# Altium schematic sheet Connectors.SchDoc
size 431 x 279 mm; Organization: Machine Intelligence Laboratory; Address1: 1889 Museum Rd; Address2: Room 3001; Address3: Gainesville, FL, 32611; SheetNumber: 1; SheetTotal: 4
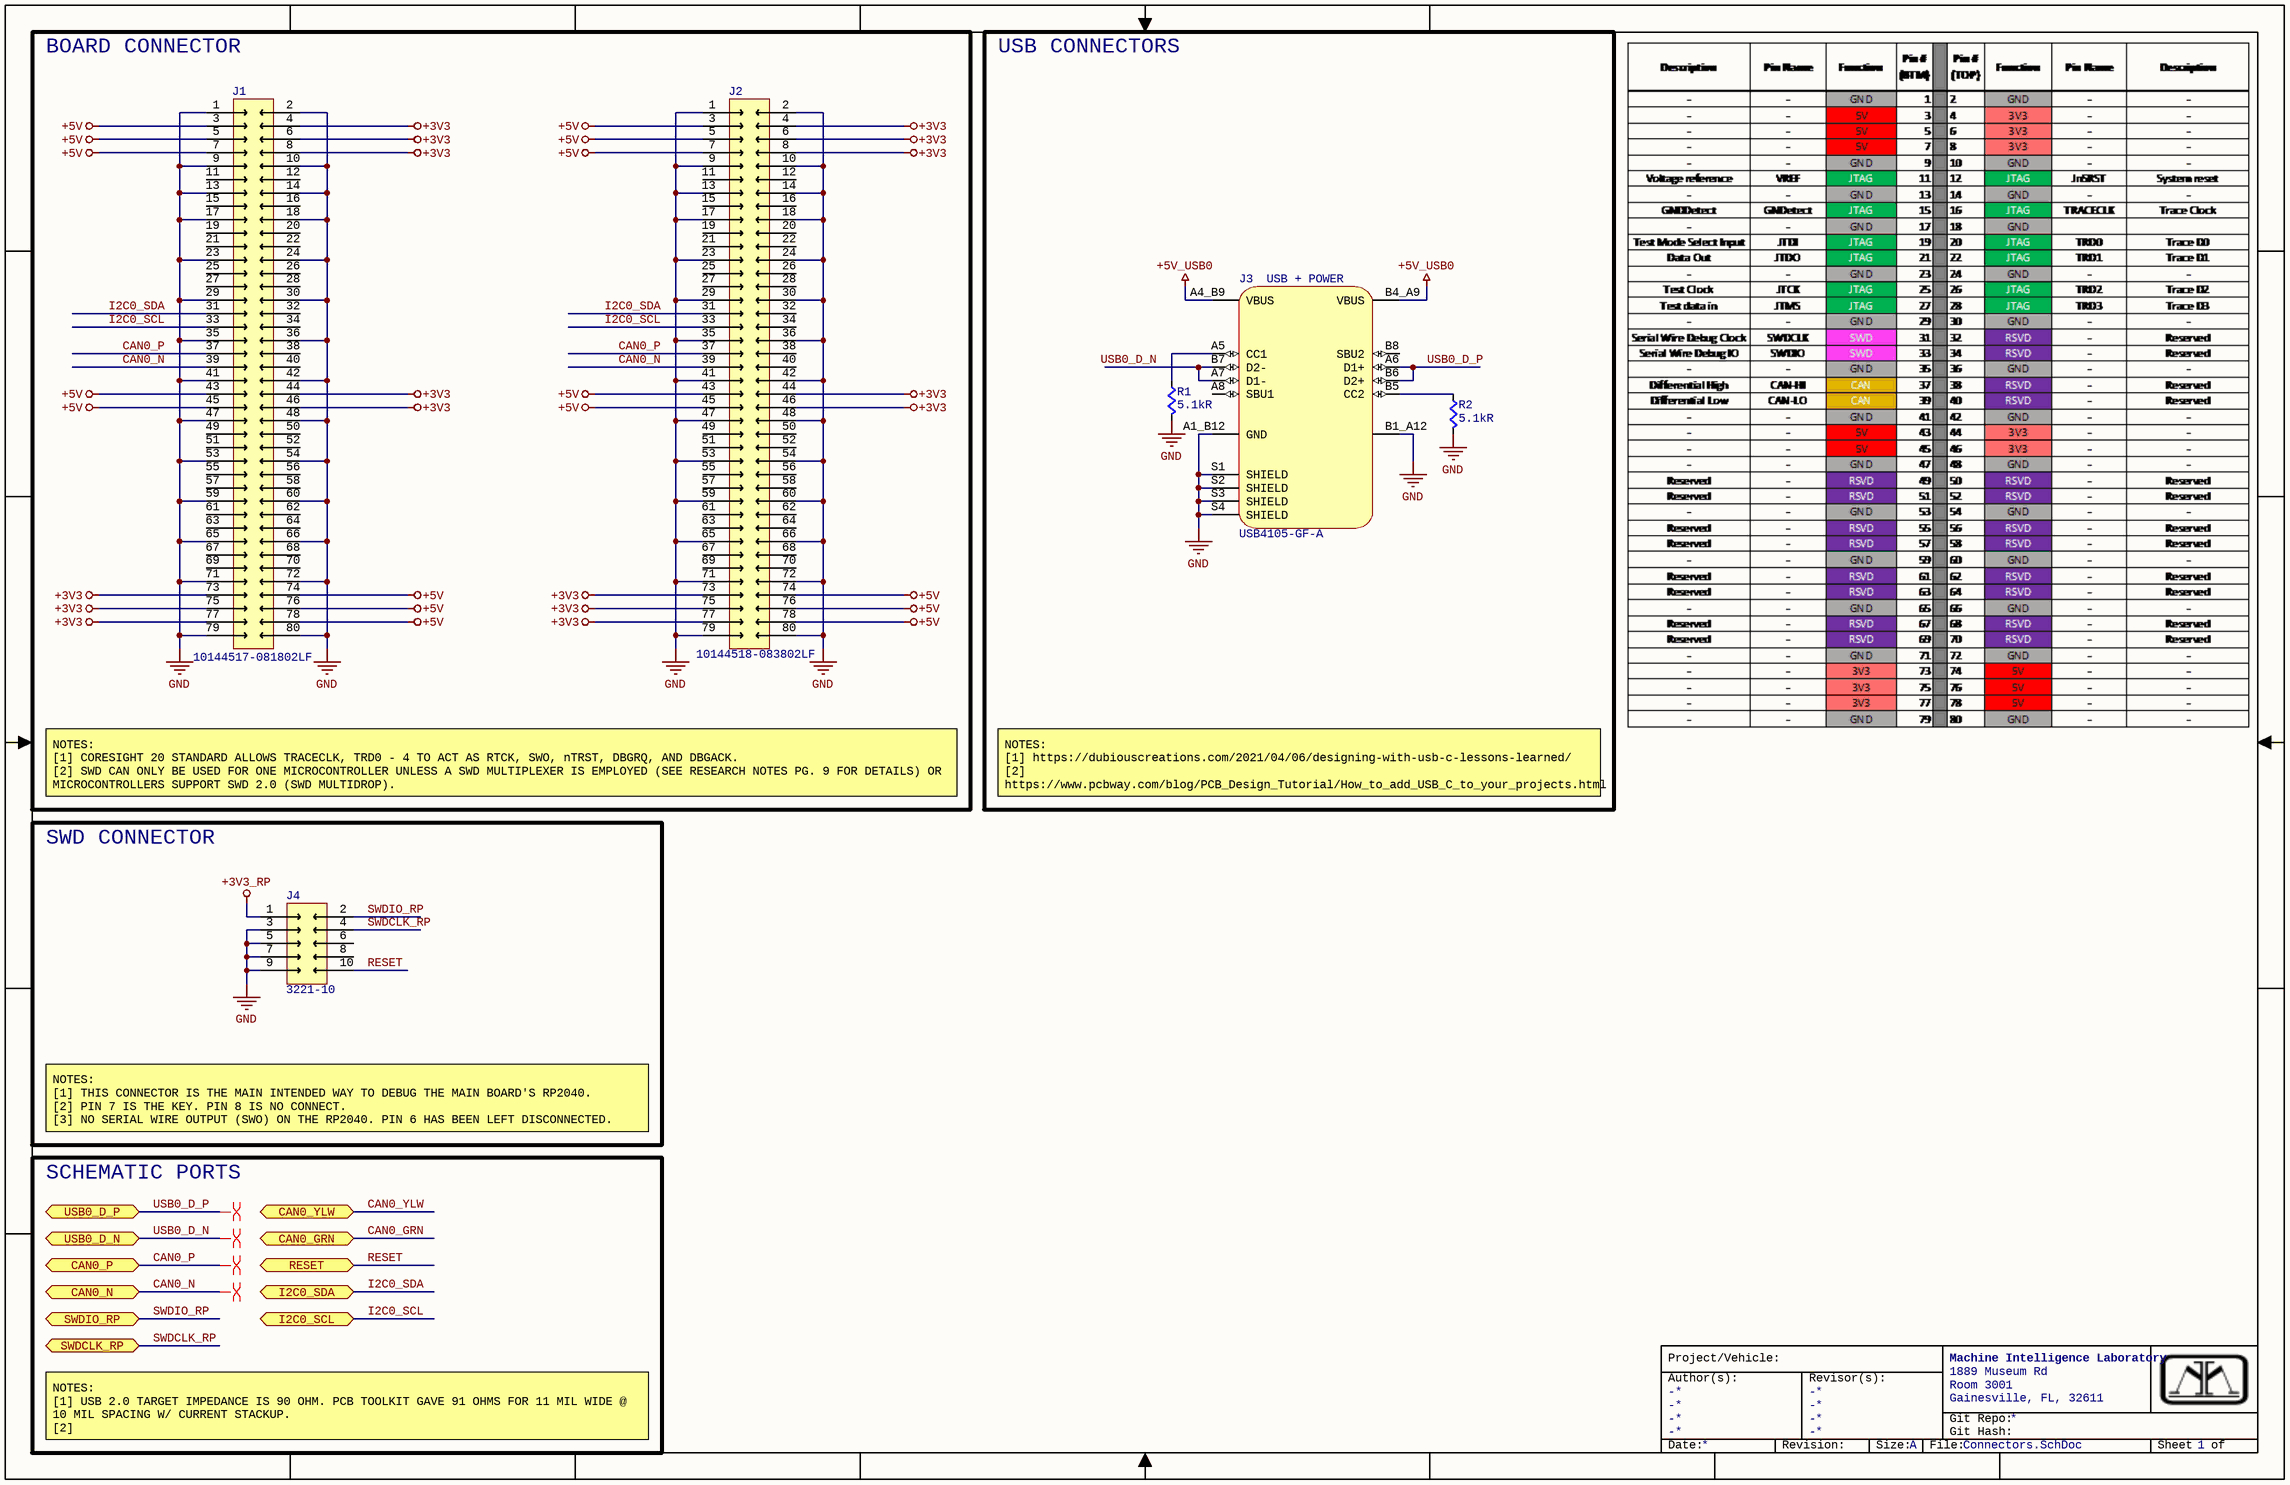
[diagram p0: Connectors.SchDoc]

## Parts
J1  10144517-081802LF  [AMPHENOL_10144517-081802LF]
J2  10144518-083802LF  [AMPHENOL_10144518-083802LF]
J3  USB4105-GF-A  [GCT_USB4105-GF-A]
J4  3221-10  [3220-10-0200-00]
R1  5.1kR  [RES0603]
R2  5.1kR  [RES0603]

## Blocks framed on the sheet
BOARD CONNECTOR: J1 J2
USB CONNECTORS: J3 R1 R2
SWD CONNECTOR: J4

## Ports
CAN0_GRN (bidir, see Microcontroller[2D], Transceivers[3A]), CAN0_N (bidir, see Transceivers[3A]), CAN0_P (bidir, see Transceivers[3A]), CAN0_YLW (bidir, see Microcontroller[2C], Transceivers[3A]), I2C0_SCL (bidir, see Microcontroller[3C]), I2C0_SDA (bidir, see Microcontroller[3C]), RESET (bidir, see Microcontroller[2D]), SWDCLK_RP (bidir, see Microcontroller[2D]), SWDIO_RP (bidir, see Microcontroller[2D]), USB0_D_N (bidir, see Microcontroller[2C]), USB0_D_P (bidir, see Microcontroller[2C])

## Nets
+3V3: J1.4 J1.6 J1.8 J1.44 J1.46 J1.73 J1.75 J1.77 J2.4 J2.6 J2.8 J2.44 J2.46 J2.73 J2.75 J2.77
+3V3_RP: J4.1
+5V: J1.3 J1.5 J1.7 J1.43 J1.45 J1.74 J1.76 J1.78 J2.3 J2.5 J2.7 J2.43 J2.45 J2.74 J2.76 J2.78
+5V_USB0: J3.A4_B9(VBUS) J3.B4_A9(VBUS)
GND: J1.1 J1.2 J1.9 J1.10 J1.13 J1.14 J1.17 J1.18 J1.23 J1.24 J1.29 J1.30 J1.35 J1.36 J1.41 J1.42 J1.47 J1.48 J1.53 J1.54 J1.59 J1.60 J1.65 J1.66 J1.71 J1.72 J1.79 J1.80 J2.1 J2.2 J2.9 J2.10 J2.13 J2.14 J2.17 J2.18 J2.23 J2.24 J2.29 J2.30 J2.35 J2.36 J2.41 J2.42 J2.47 J2.48 J2.53 J2.54 J2.59 J2.60 J2.65 J2.66 J2.71 J2.72 J2.79 J2.80 J3.A1_B12(GND) J3.B1_A12(\) J3.S1(SHIELD) J3.S2(SHIELD) J3.S3(SHIELD) J3.S4(SHIELD) J4.3 J4.5 J4.7 J4.9 R1.1(A) R2.1(A)
CAN0_GRN: port CAN0_GRN
CAN0_N: J1.39 J2.39 ; port CAN0_N
CAN0_P: J1.37 J2.37 ; port CAN0_P
CAN0_YLW: port CAN0_YLW
I2C0_SCL: J1.33 J2.33 ; port I2C0_SCL
I2C0_SDA: J1.31 J2.31 ; port I2C0_SDA
RESET: J4.10 ; port RESET
SWDCLK_RP: J4.4 ; port SWDCLK_RP
SWDIO_RP: J4.2 ; port SWDIO_RP
USB0_D_N: J3.A7(D1-) J3.B7(D2-) ; port USB0_D_N
USB0_D_P: J3.A6(D1+) J3.B6(D2+) ; port USB0_D_P
NetJ3_A5: J3.A5(CC1) R1.2(B)
NetJ3_B5: J3.B5(CC2) R2.2(B)

Not connected (* = marked no-connect by the designer): J1 11 12 15 16 19 20 21 22 25 26 27 28 32 34 38 40 49 50 51 52 55 56 57 58 61 62 63 64 67 68 69 70; J2 11 12 15 16 19 20 21 22 25 26 27 28 32 34 38 40 49 50 51 52 55 56 57 58 61 62 63 64 67 68 69 70; J3 A8(SBU1) B8(SBU2); J4 6 8

## Layout directives
differential pair; net class USB0_D; differential pair class USB0_LINES; rule Matched Net Lengths [Tolerance = 10mil]; rule Differential Pairs Routing [Pref Gap = 4mil    Min Gap  = 4mil    Max Gap  = 4milPref Width = 6mil    Min Width  = 6mil    Max Width  = 6mil]: USB0_D_N, USB0_D_P
differential pair; rule Matched Net Lengths [Tolerance = 5mil]; rule Differential Pairs Routing [Pref Gap = 6mil    Min Gap  = 6mil    Max Gap  = 6milPref Width = 4mil    Min Width  = 4mil    Max Width  = 4mil]; net class CAN0; differential pair class CAN0_LINES: CAN0_N, CAN0_P

## Notes on the sheet
- (near J3) USB + POWER
- NOTES:
  [1] CORESIGHT 20 STANDARD ALLOWS TRACECLK, TRD0 - 4 TO ACT AS RTCK, SWO, nTRST, DBGRQ, AND DBGACK.
  [2] SWD CAN ONLY BE USED FOR ONE MICROCONTROLLER UNLESS A SWD MULTIPLEXER IS EMPLOYED (SEE RESEARCH NOTES PG. 9 FOR DETAILS) OR MICROCONTROLLERS SUPPORT SWD 2.0 (SWD MULTIDROP).
- NOTES:
  [1] https://dubiouscreations.com/2021/04/06/designing-with-usb-c-lessons-learned/
  [2] https://www.pcbway.com/blog/PCB_Design_Tutorial/How_to_add_USB_C_to_your_projects.html
  [3] DO NOT FORGET TO SECURE THE MECHANICAL POLES BEFORE CONNECTING ANYTHING.
- NOTES:
  [1] THIS CONNECTOR IS THE MAIN INTENDED WAY TO DEBUG THE MAIN BOARD'S RP2040.
  [2] PIN 7 IS THE KEY. PIN 8 IS NO CONNECT.
  [3] NO SERIAL WIRE OUTPUT (SWO) ON THE RP2040. PIN 6 HAS BEEN LEFT DISCONNECTED.
- SCHEMATIC PORTS
- NOTES:
  [1] USB 2.0 TARGET IMPEDANCE IS 90 OHM. PCB TOOLKIT GAVE 91 OHMS FOR 11 MIL WIDE @ 10 MIL SPACING W/ CURRENT STACKUP.
  [2] http://lamsimenterprises.com/COUPLED%20TRANSMISSION%20LINES%20AND%20Crosstalk.pdf
- Project/Vehicle:
- Author(s):
- -
- Revisor(s):
- Git Repo:
- Git Hash:
- Date:
- Revision:
- Size:
- A
- File:
- Sheet
- of

## Library data of the parts
J1 = 10144517-081802LF: CONN RCPT 1 80POS SMD GOLD; System: Connector; Supplier 1: Digikey; Supplier Part Number 1: 609-5437-1-ND
J2 = 10144518-083802LF: CONN PLUG 3 80POS SMD GOLD; System: Connector; Supplier 1: Digikey; Supplier Part Number 1: 609-5455-1-ND
J3 = USB4105-GF-A: USB-C (USB TYPE-C) USB 2.0 Receptacle Connector 24 (16+8 Dummy) Position Surface Mount, Right Angle; Through Hole; MP: USB4120-03-C_REVA; Package: None; Value: *; Availability: Unavailable; Price: None; Supplier 1: Newark; Supplier Part Number 1: 71AJ9393
J4 = 3221-10-0300-00: Connector Header Surface Mount 10 position 0.050" (1.27mm); Supplier 1: Digikey; Supplier Part Number 1: 1175-1735-ND
R1 R2 = RC0603FR-075K1L: Fixed Resistor, Metal Glaze/thick F; Manufacturer: Yageo; Power: 100mW; Rated Temperature: 70°C; Tolerance: 1%; Additional Feature: LASER TRIMMABLE; Temperature Coefficient: 100ppm/°C; Working Voltage: 75V; Package Height: 0.45mm; Package Length: 1.6mm; Package Width: 0.8mm; Part Number: RC0603FR-075K1L; Category: Chip SMD Resistors; Stock 1: 2654160; Pricing 1: 1=0.1, 10=0.019, 50=0.0112, 100=0.0; Mounting Technology: Surface Mount; Pins: 2; Package Shape: Rectangular; Case/Package: 0603; Terminal Finish: Nickel; Min Operating Temperature: -55°C; Max Operating Temperature: 155°C; JESD-609 Code: e3; Resistor Type: FIXED RESISTOR; Packaging: Tape and Reel; Value: 5.1kR; Termination: Wraparound; Technology: METAL GLAZE/THICK FILM; Reach SVHC Compliant: Yes; RoHS Compliant: Yes; ComponentLink1URL: https://datasheet.ciiva.com:443/pdf; ComponentLink1Description: https://datasheet.ciiva.com:443/pdf; ComponentLink2URL: https://datasheet.ciiva.com/46395/4; ComponentLink2Description: https://datasheet.ciiva.com/46395/4; ComponentLink3URL: https://datasheet.ciiva.com/2454/py; ComponentLink3Description: https://datasheet.ciiva.com/2454/py; ComponentLink4URL: https://datasheet.ciiva.com/2454/py; ComponentLink4Description: https://datasheet.ciiva.com/2454/py; ComponentLink5URL: https://datasheet.ciiva.com/2454/py; ComponentLink5Description: https://datasheet.ciiva.com/2454/py; ComponentLink6URL: https://datasheet.ciiva.com/15189/g; ComponentLink6Description: https://datasheet.ciiva.com/15189/g; Supplier Part Number 1: 311-5.10KHRCT-ND; Manufacturer Part Number: RC0603FR-075K1L; RoHS: Yes; Construction: Chip; Package Style: SMTMeter; Supplier 1: Digikey